# Altium schematic sheet levit_0.1 .SchDoc
size A1; SheetNumber: 1; SheetTotal: 1
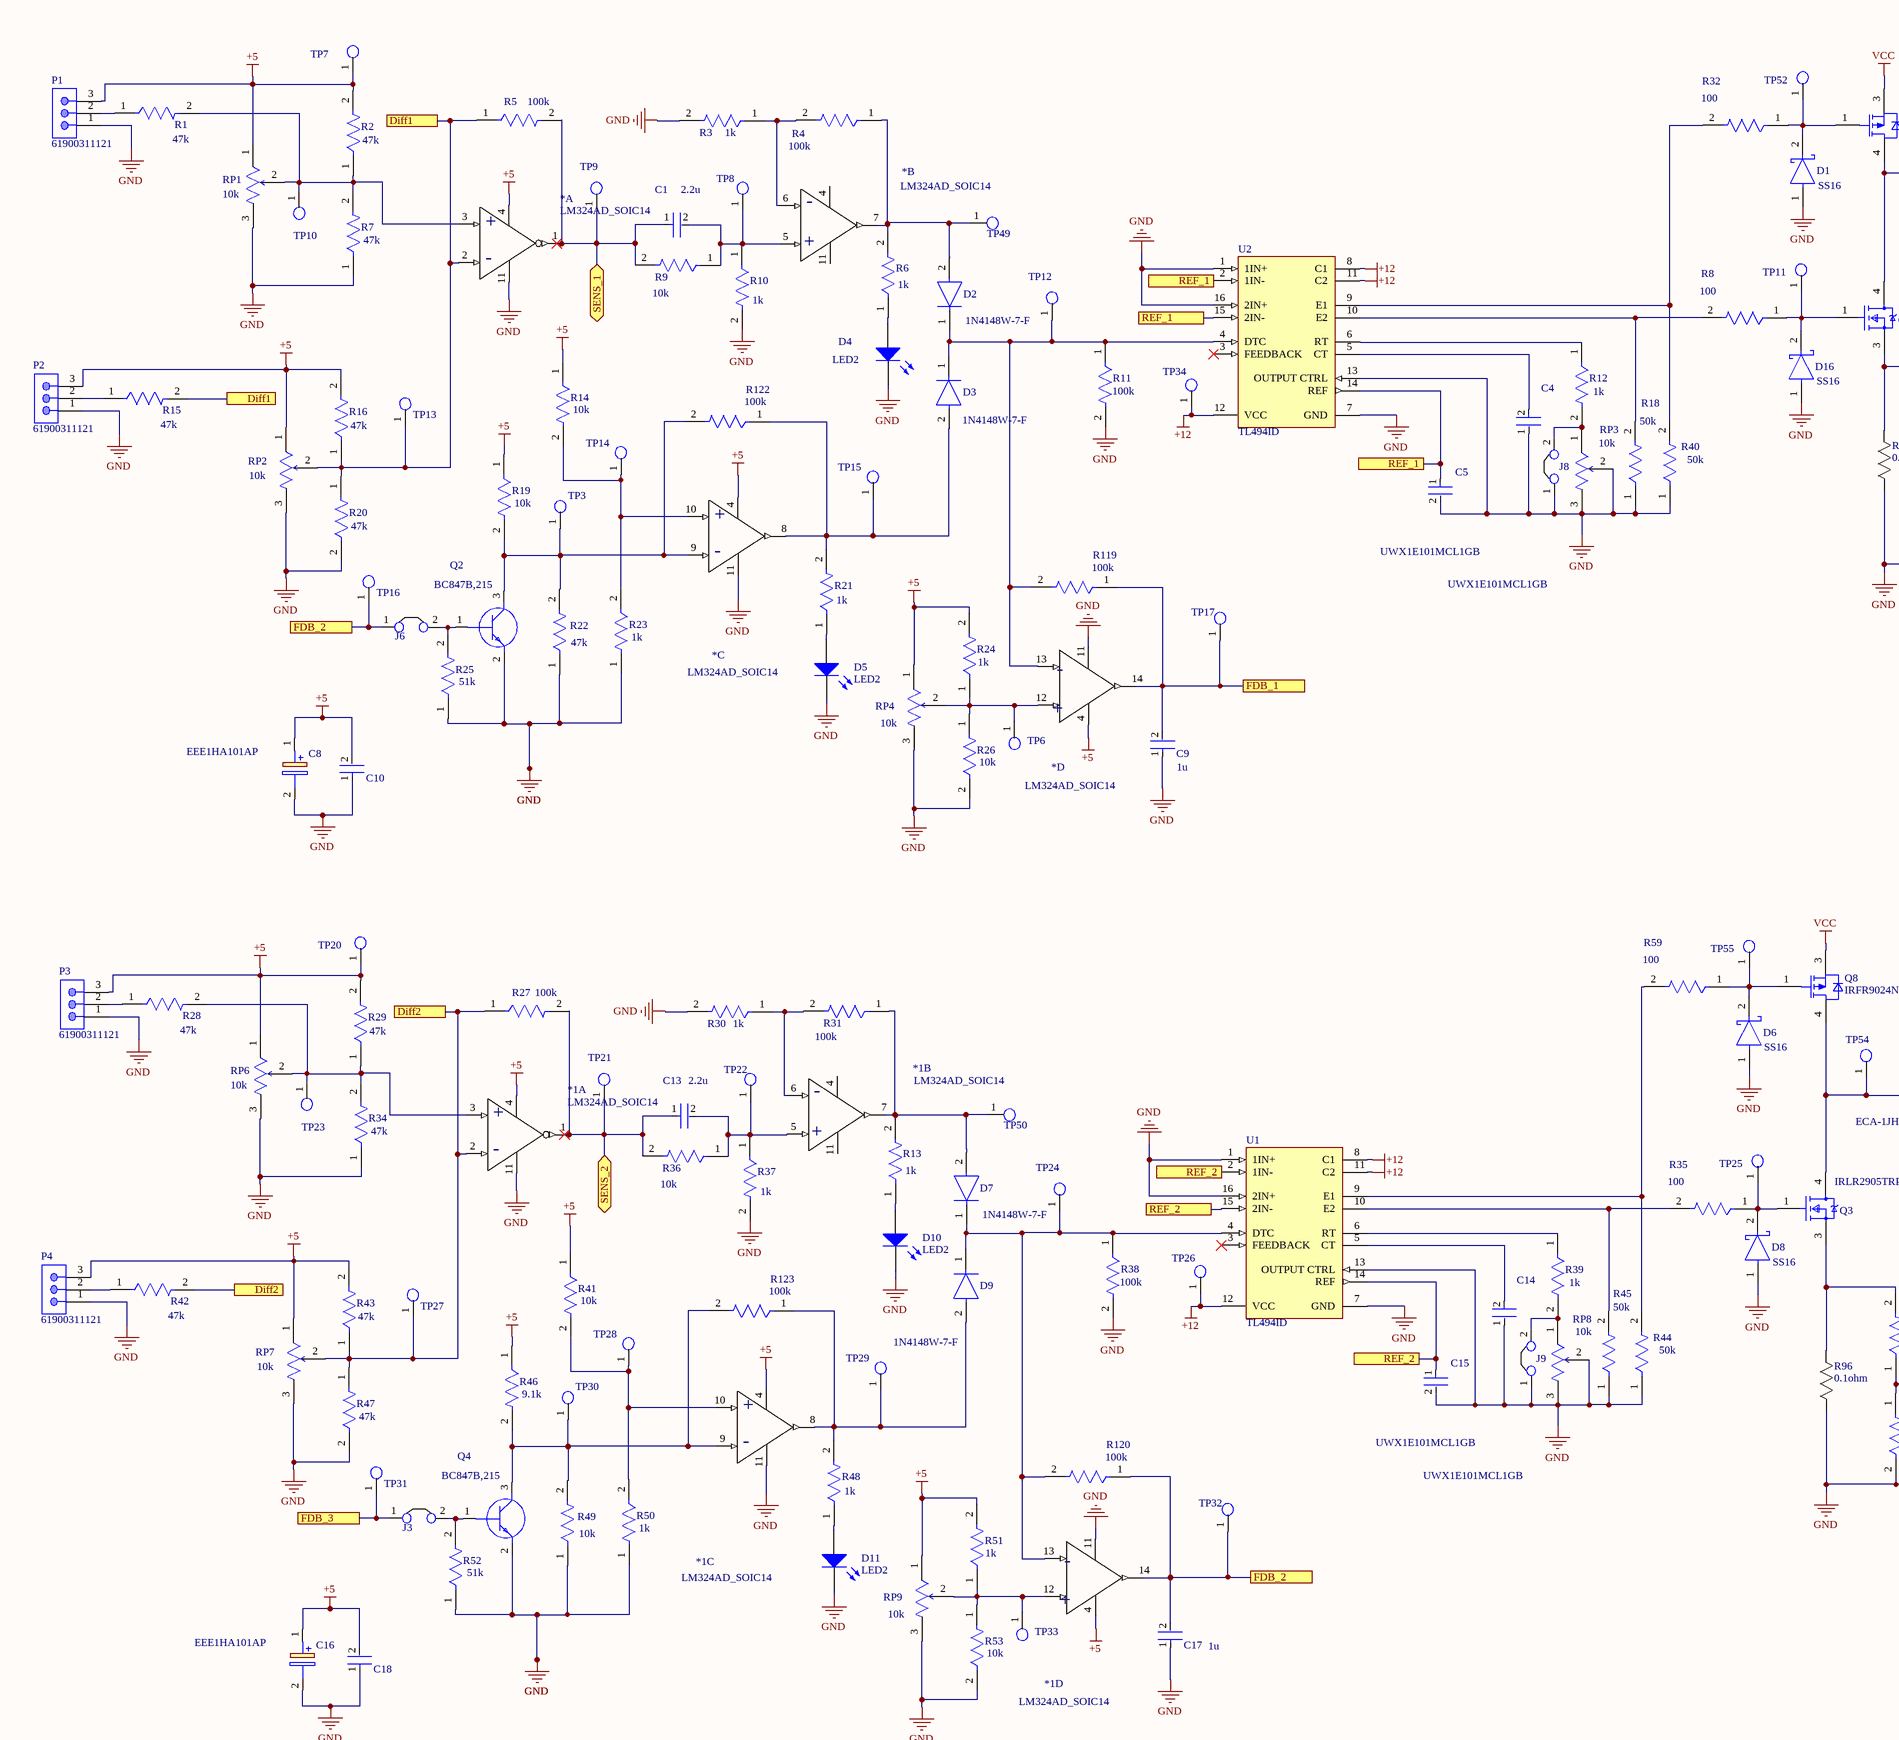
[diagram p0: levit_0.1 .SchDoc, top left]
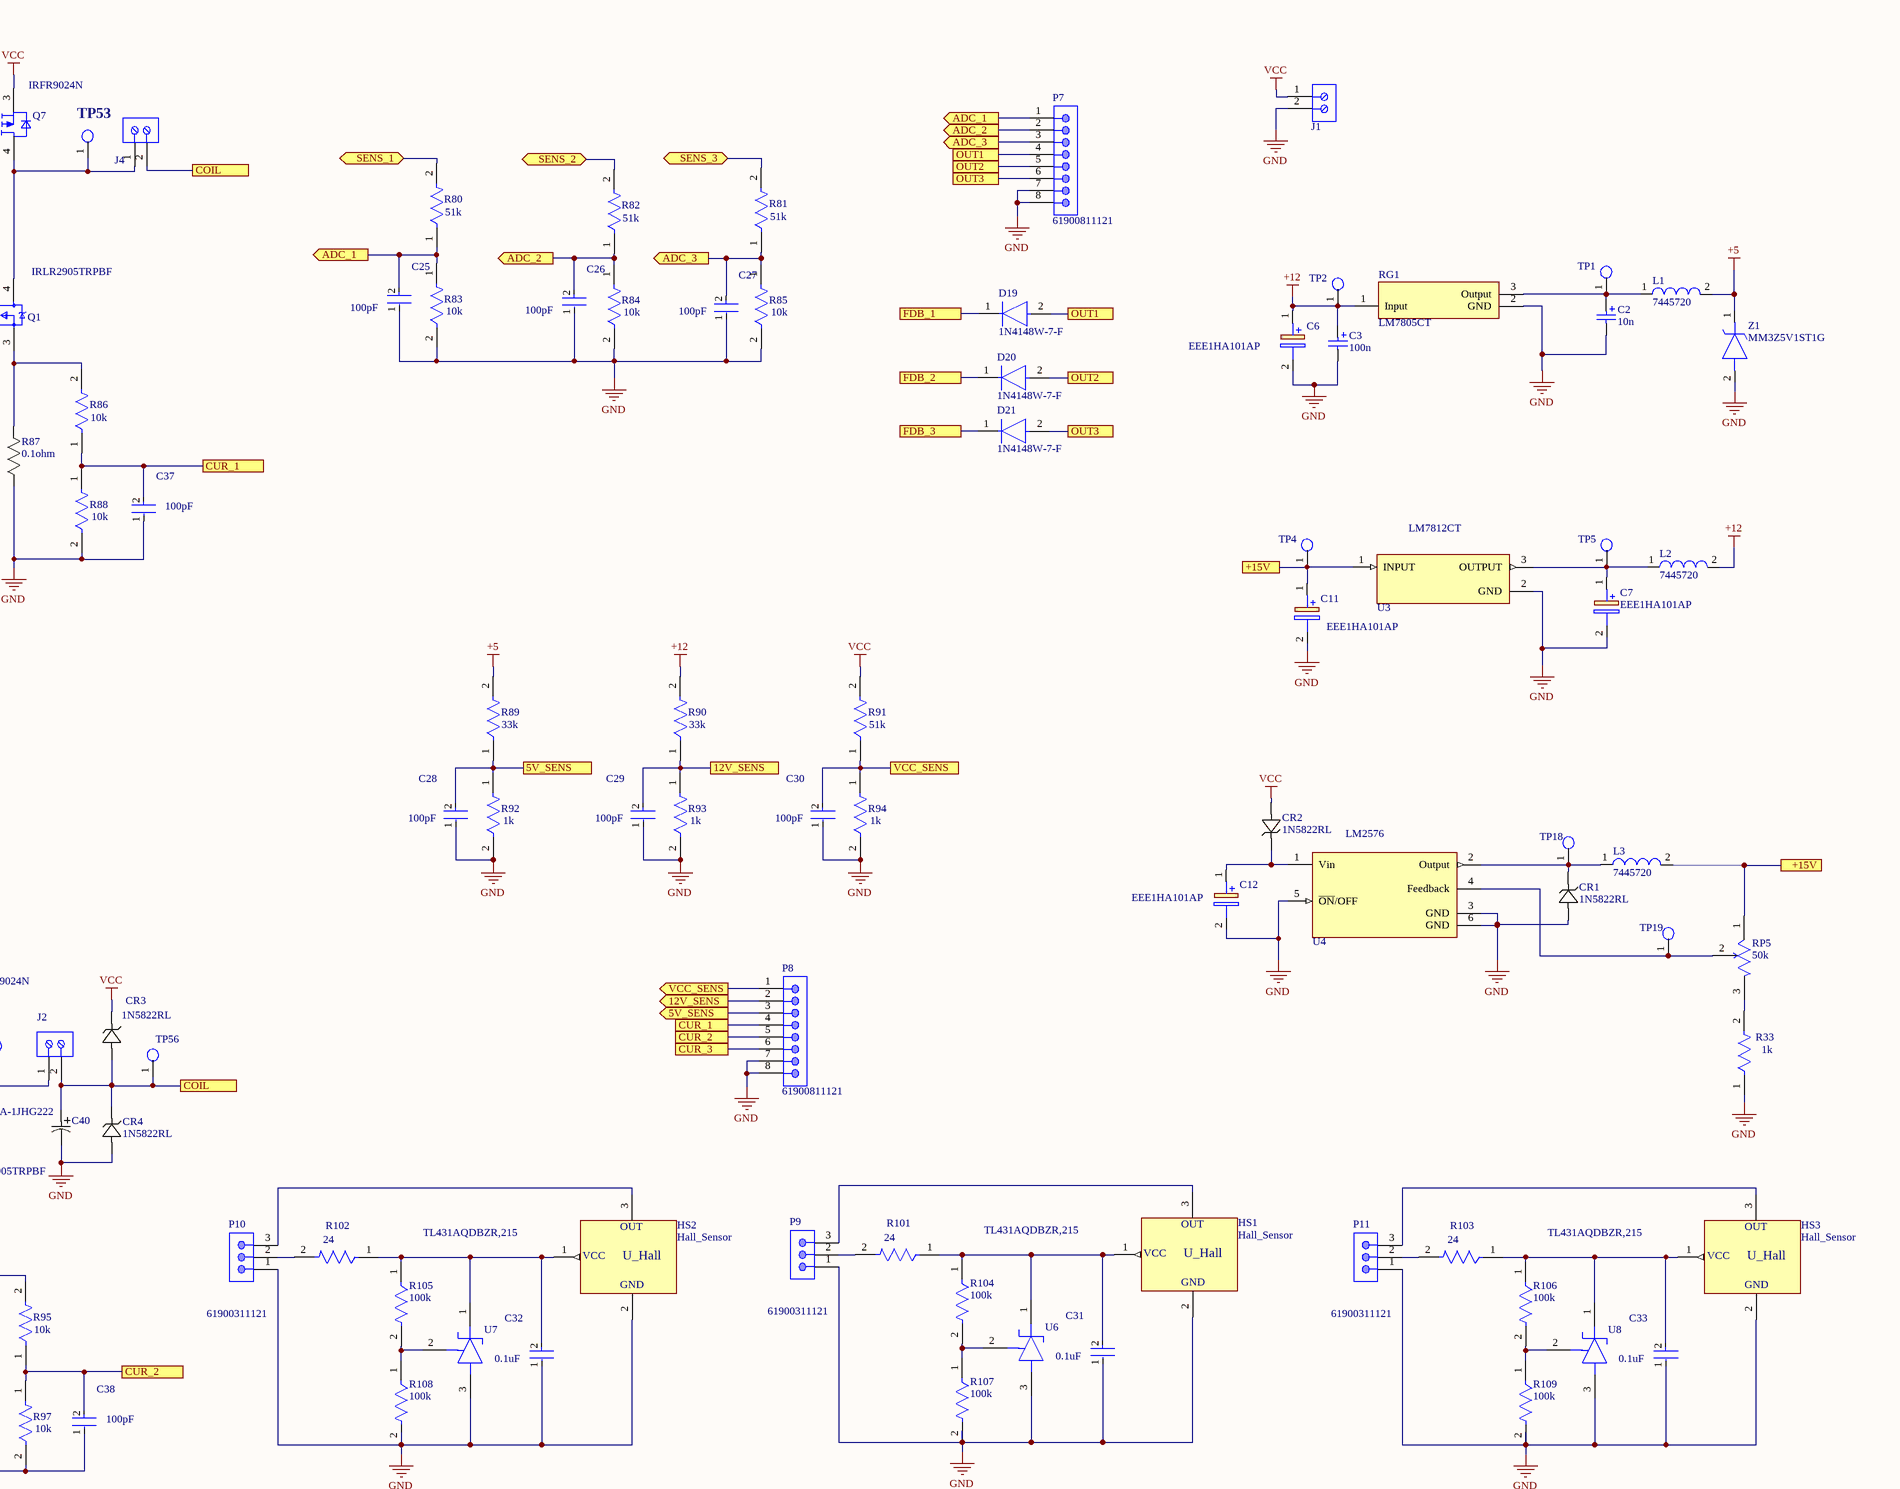
[diagram p1: levit_0.1 .SchDoc, top right]
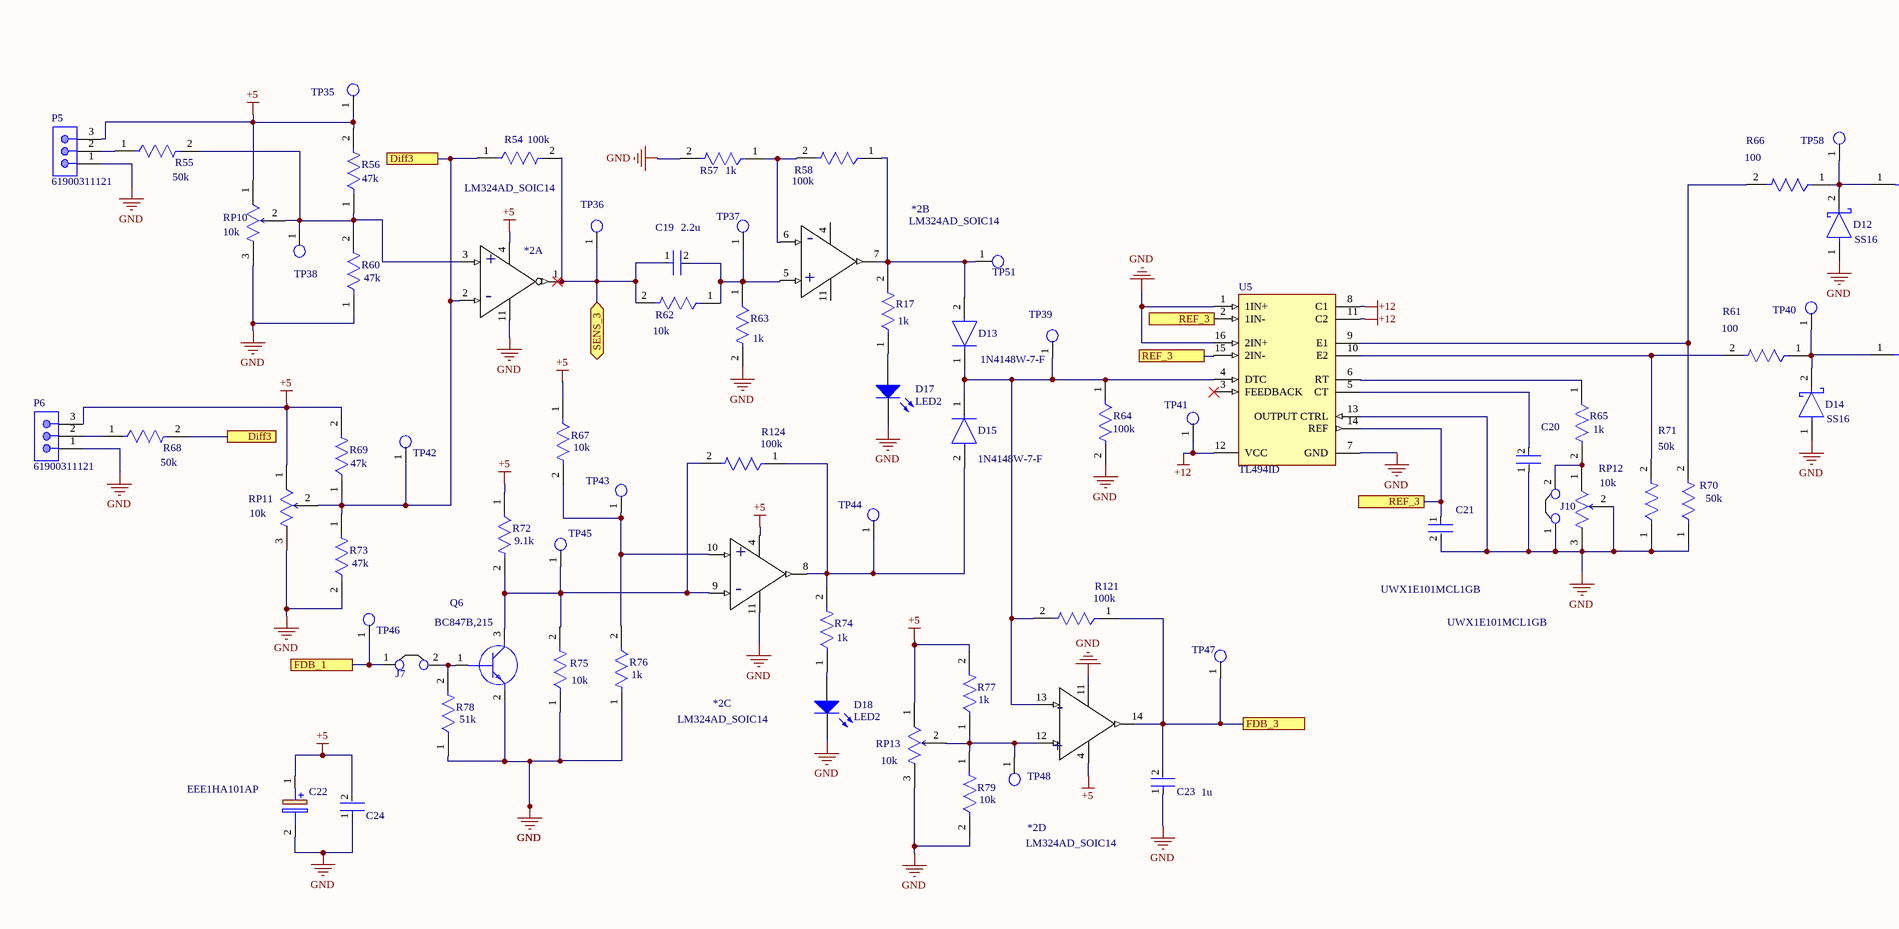
[diagram p2: levit_0.1 .SchDoc, bottom left]
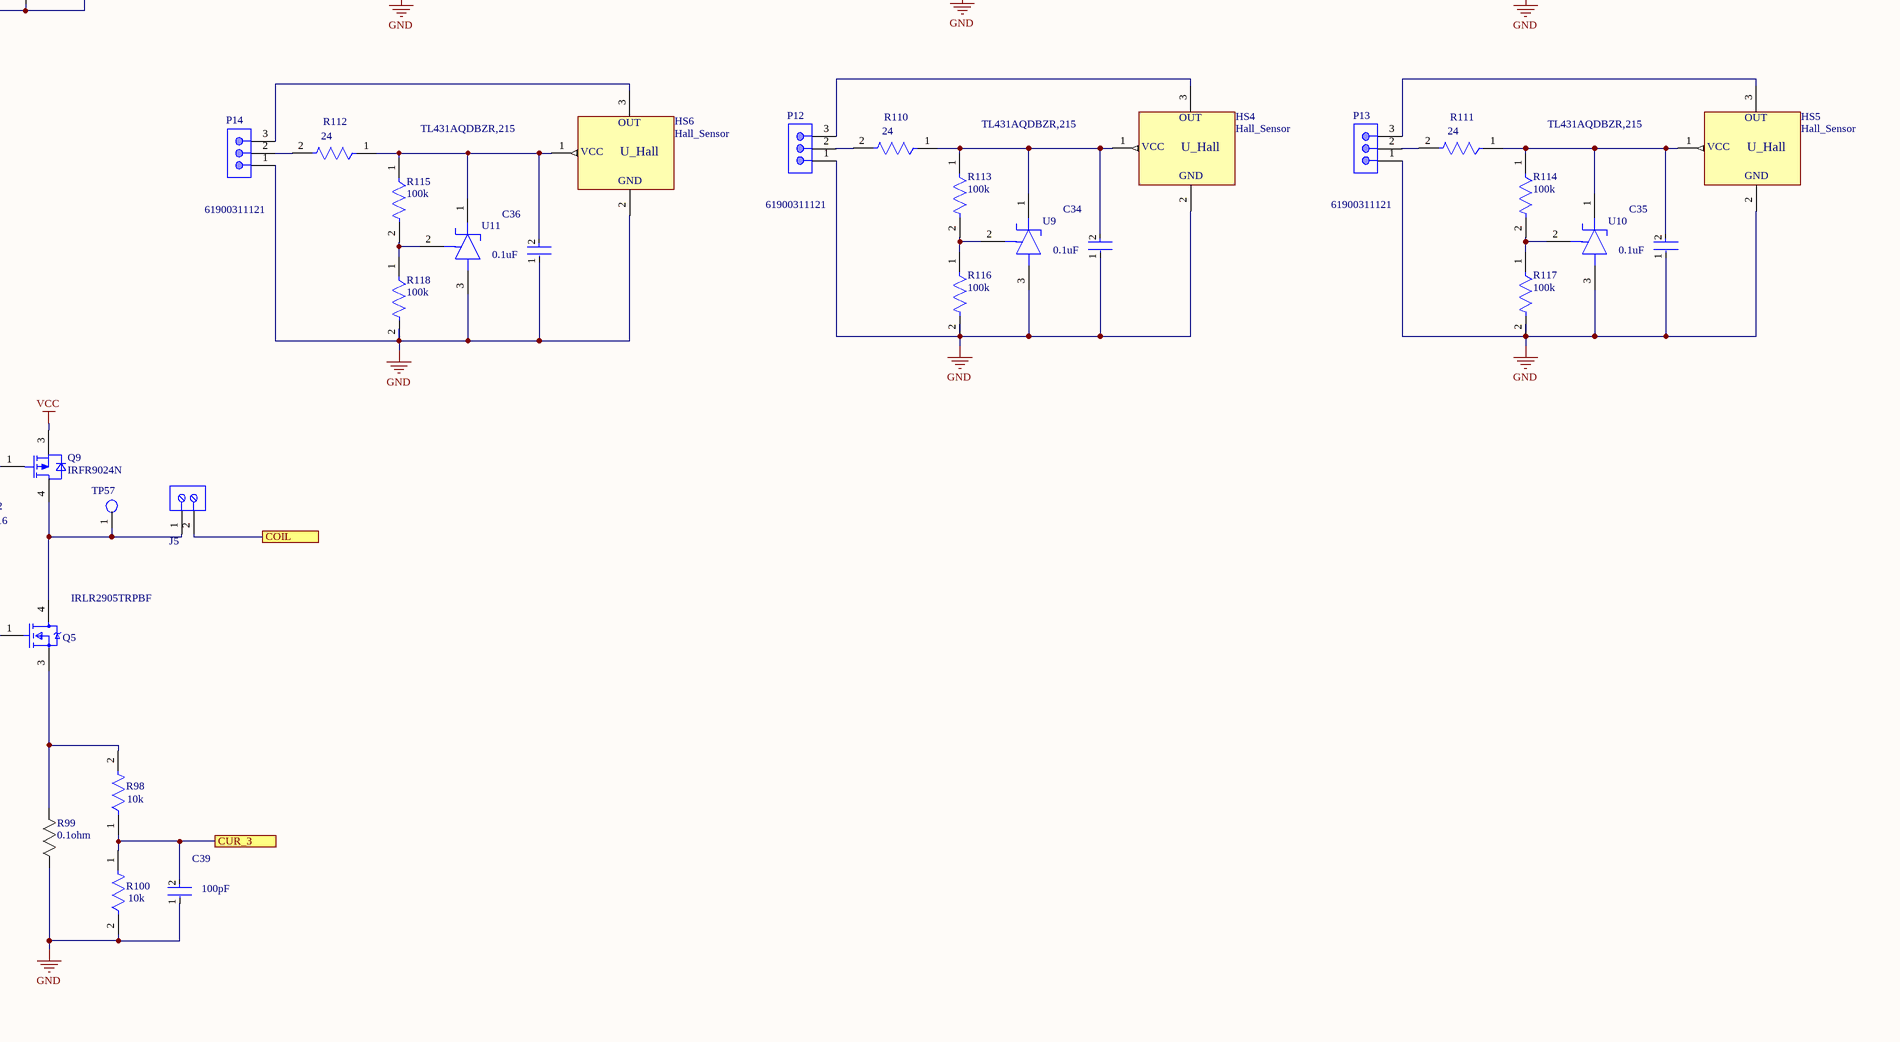
[diagram p3: levit_0.1 .SchDoc, bottom right]

## Parts
(Parts that share a designator on the sheet are numbered #1, #2 ... from top to bottom, then left to right.)
*1  LM324AD_SOIC14  [D14-M]  (parts A,B,C,D of 4)
*2  LM324AD_SOIC14  [D14-M]  (parts A,B,C,D of 4)
*#1  LM324AD_SOIC14  [D14-M]  (part B of 4)
*#2  LM324AD_SOIC14  [D14-M]  (part A of 4)
*#3  LM324AD_SOIC14  [D14-M]  (part C of 4)
*#4  LM324AD_SOIC14  [D14-M]  (part D of 4)
C1  2.2u  [KEMET_C0805C-DN_IPC_A]
C2  10n  [KEMET_C0805C-DN_IPC_A]
C3  100n  [KEMET_C0805C-DN_IPC_A]
C4  UWX1E101MCL1GB  [KEMET_C0805C-DN_IPC_A]
C5  UWX1E101MCL1GB  [KEMET_C0805C-DN_IPC_A]
C6  EEE1HA101AP  [EEEFK1V331P]
C7  EEE1HA101AP  [EEEFK1V331P]
C8  EEE1HA101AP  [EEEFK1V331P]
C9  1u  [KEMET_C0805C-DN_IPC_A]
C10  1u  [KEMET_C0805C-DN_IPC_A]  (value not drawn)
C11  EEE1HA101AP  [EEEFK1V331P]
C12  EEE1HA101AP  [EEEFK1V331P]
C13  2.2u  [KEMET_C0805C-DN_IPC_A]
C14  UWX1E101MCL1GB  [KEMET_C0805C-DN_IPC_A]
C15  UWX1E101MCL1GB  [KEMET_C0805C-DN_IPC_A]
C16  EEE1HA101AP  [EEEFK1V331P]
C17  1u  [KEMET_C0805C-DN_IPC_A]
C18  1u  [KEMET_C0805C-DN_IPC_A]  (value not drawn)
C19  2.2u  [KEMET_C0805C-DN_IPC_A]
C20  UWX1E101MCL1GB  [KEMET_C0805C-DN_IPC_A]
C21  UWX1E101MCL1GB  [KEMET_C0805C-DN_IPC_A]
C22  EEE1HA101AP  [EEEFK1V331P]
C23  1u  [KEMET_C0805C-DN_IPC_A]
C24  1u  [KEMET_C0805C-DN_IPC_A]  (value not drawn)
C25  100pF  [KEMET_C0805C-DN_IPC_A]
C26  100pF  [KEMET_C0805C-DN_IPC_A]
C27  100pF  [KEMET_C0805C-DN_IPC_A]
C28  100pF  [KEMET_C0805C-DN_IPC_A]
C29  100pF  [KEMET_C0805C-DN_IPC_A]
C30  100pF  [KEMET_C0805C-DN_IPC_A]
C31  0.1uF  [KEMET_C0805C-DN_IPC_C]
C32  0.1uF  [KEMET_C0805C-DN_MFG]
C33  0.1uF  [KEMET_C0805C-DN_IPC_C]
C34  0.1uF  [KEMET_C0805C-DN_IPC_C]
C35  0.1uF  [KEMET_C0805C-DN_IPC_C]
C36  0.1uF  [KEMET_C0805C-DN_MFG]
C37  100pF  [KEMET_C0805C-DN_IPC_A]
C38  100pF  [KEMET_C0805C-DN_IPC_A]
C39  100pF  [KEMET_C0805C-DN_IPC_A]
C40  ECA-1JHG222  [PCAP_18x355_PAN]
CR1  1N5822RL  [DO-201AD_STM]
CR2  1N5822RL  [DO-201AD_STM]
CR3  1N5822RL  [DO-201AD_STM]
CR4  1N5822RL  [DO-201AD_STM]
D1  SS16  [ON_Semi_403D_MFG]
D2  1N4148W-7-F  [Vishay_S8-V-3910_01-001_IPC_A]
D3  1N4148W-7-F  [Vishay_S8-V-3910_01-001_IPC_A]
D4  LED2  [Wurth_Electronics_0_MFG]
D5  LED2  [Wurth_Electronics_0_MFG]
D6  SS16  [ON_Semi_403D_MFG]
D7  1N4148W-7-F  [Vishay_S8-V-3910_01-001_IPC_A]
D8  SS16  [Vishay_SS16-E3-61T_0]
D9  1N4148W-7-F  [Vishay_S8-V-3910_01-001_IPC_A]
D10  LED2  [Wurth_Electronics_0_MFG]
D11  LED2  [Wurth_Electronics_0_MFG]
D12  SS16  [ON_Semi_403D_MFG]
D13  1N4148W-7-F  [Vishay_S8-V-3910_01-001_IPC_A]
D14  SS16  [ON_Semi_403D_MFG]
D15  1N4148W-7-F  [Vishay_S8-V-3910_01-001_IPC_A]
D16  SS16  [ON_Semi_403D_MFG]
D17  LED2  [Wurth_Electronics_0_MFG]
D18  LED2  [Wurth_Electronics_0_MFG]
D19  1N4148W-7-F  [Vishay_S8-V-3910_01-001_IPC_A]
D20  1N4148W-7-F  [Vishay_S8-V-3910_01-001_IPC_A]
D21  1N4148W-7-F  [Vishay_S8-V-3910_01-001_IPC_A]
HS1  Hall_Sensor  [TO-92A]
HS2  Hall_Sensor  [TO-92A]
HS3  Hall_Sensor  [TO-92A]
HS4  Hall_Sensor  [TO-92A]
HS5  Hall_Sensor  [TO-92A]
HS6  Hall_Sensor  [TO-92A]
J1  691103110003  [691101710002]  (value not drawn)
J2  691101710002  [691101710002]  (value not drawn)
J3  Jumper 1x2.54  [Jumper_2.54]  (value not drawn)
J4  691101710002  [691101710002]  (value not drawn)
J5  691101710002  [691101710002]  (value not drawn)
J6  Jumper 1x2.54  [Jumper_2.54]  (value not drawn)
J7  Jumper 1x2.54  [Jumper_2.54]  (value not drawn)
J8  Jumper 1x2.54  [Jumper_2.54]  (value not drawn)
J9  Jumper 1x2.54  [Jumper_2.54]  (value not drawn)
J10  Jumper 1x2.54  [Jumper_2.54]  (value not drawn)
L1  7445720  [WE-PD2-L]
L2  7445720  [WE-PD2-L]
L3  7445720  [WE-PD2-L]
P1  61900311121  [61900311121]
P2  61900311121  [61900311121]
P3  61900311121  [61900311121]
P4  61900311121  [61900311121]
P5  61900311121  [61900311121]
P6  61900311121  [61900311121]
P7  61900811121  [61900811121]
P8  61900811121  [61900811121]
P9  61900311121  [61900311121]
P10  61900311121  [61900311121]
P11  61900311121  [61900311121]
P12  61900311121  [61900311121]
P13  61900311121  [61900311121]
P14  61900311121  [61900311121]
Q1  IRLR2905TRPBF  [Infineon_Technologies_PG-TO252-3_MFG]
Q2  BC847B,215  [BC847B215]
Q3  IRLR2905TRPBF  [Infineon_Technologies_PG-TO252-3_MFG]
Q4  BC847B,215  [BC847B215]
Q5  IRLR2905TRPBF  [Infineon_Technologies_PG-TO252-3_MFG]
Q6  BC847B,215  [BC847B215]
Q7  IRFR9024N  [Infineon_Technologies_PG-TO252-3_MFG]
Q8  IRFR9024N  [Infineon_Technologies_PG-TO252-3_MFG]
Q9  IRFR9024N  [Infineon_Technologies_PG-TO252-3_MFG]
R1  47k  [Vishay_CRCW0805-e3_IPC_A]
R2  47k  [Vishay_CRCW0805-e3_IPC_A]
R3  1k  [Vishay_CRCW0805-e3_IPC_A]
R4  100k  [Vishay_CRCW0805-e3_IPC_A]
R5  100k  [Vishay_CRCW0805-e3_IPC_A]
R6  1k  [Vishay_CRCW0805-e3_IPC_A]
R7  47k  [Vishay_CRCW0805-e3_IPC_A]
R8  100  [Vishay_CRCW0805-e3_IPC_A]
R9  10k  [Vishay_CRCW0805-e3_IPC_A]
R10  1k  [Vishay_CRCW0805-e3_IPC_A]
R11  100k  [Vishay_CRCW0805-e3_IPC_A]
R12  1k  [Vishay_CRCW0805-e3_IPC_A]
R13  1k  [Vishay_CRCW0805-e3_IPC_A]
R14  10k  [Vishay_CRCW0805-e3_IPC_A]
R15  47k  [Vishay_CRCW0805-e3_IPC_A]
R16  47k  [Vishay_CRCW0805-e3_IPC_A]
R17  1k  [Vishay_CRCW0805-e3_IPC_A]
R18  50k  [Vishay_CRCW0805-e3_IPC_A]
R19  10k  [Vishay_CRCW0805-e3_IPC_A]
R20  47k  [Vishay_CRCW0805-e3_IPC_A]
R21  1k  [Vishay_CRCW0805-e3_IPC_A]
R22  47k  [Vishay_CRCW0805-e3_IPC_A]
R23  1k  [Vishay_CRCW0805-e3_IPC_A]
R24  1k  [Vishay_CRCW0805-e3_IPC_A]
R25  51k  [Vishay_CRCW0805-e3_IPC_A]
R26  10k  [Vishay_CRCW0805-e3_IPC_A]
R27  100k  [Vishay_CRCW0805-e3_IPC_A]
R28  47k  [Vishay_CRCW0805-e3_IPC_A]
R29  47k  [Vishay_CRCW0805-e3_IPC_A]
R30  1k  [Vishay_CRCW0805-e3_IPC_A]
R31  100k  [Vishay_CRCW0805-e3_IPC_A]
R32  100  [Vishay_CRCW0805-e3_IPC_A]
R33  1k  [Vishay_CRCW0805-e3_IPC_A]
R34  47k  [Vishay_CRCW0805-e3_IPC_A]
R35  100  [Vishay_CRCW0805-e3_IPC_A]
R36  10k  [Vishay_CRCW0805-e3_IPC_A]
R37  1k  [Vishay_CRCW0805-e3_IPC_A]
R38  100k  [Vishay_CRCW0805-e3_IPC_A]
R39  1k  [Vishay_CRCW0805-e3_IPC_A]
R40  50k  [Vishay_CRCW0805-e3_IPC_A]
R41  10k  [Vishay_CRCW0805-e3_IPC_A]
R42  47k  [Vishay_CRCW0805-e3_IPC_A]
R43  47k  [Vishay_CRCW0805-e3_IPC_A]
R44  50k  [Vishay_CRCW0805-e3_IPC_A]
R45  50k  [Vishay_CRCW0805-e3_IPC_A]
R46  9.1k  [Vishay_CRCW0805-e3_IPC_A]
R47  47k  [Vishay_CRCW0805-e3_IPC_A]
R48  1k  [Vishay_CRCW0805-e3_IPC_A]
R49  10k  [Vishay_CRCW0805-e3_IPC_A]
R50  1k  [Vishay_CRCW0805-e3_IPC_A]
R51  1k  [Vishay_CRCW0805-e3_IPC_A]
R52  51k  [Vishay_CRCW0805-e3_IPC_A]
R53  10k  [Vishay_CRCW0805-e3_IPC_A]
R54  100k  [Vishay_CRCW0805-e3_IPC_A]
R55  50k  [Vishay_CRCW0805-e3_IPC_A]
R56  47k  [Vishay_CRCW0805-e3_IPC_A]
R57  1k  [Vishay_CRCW0805-e3_IPC_A]
R58  100k  [Vishay_CRCW0805-e3_IPC_A]
R59  100  [Vishay_CRCW0805-e3_IPC_A]
R60  47k  [Vishay_CRCW0805-e3_IPC_A]
R61  100  [Vishay_CRCW0805-e3_IPC_A]
R62  10k  [Vishay_CRCW0805-e3_IPC_A]
R63  1k  [Vishay_CRCW0805-e3_IPC_A]
R64  100k  [Vishay_CRCW0805-e3_IPC_A]
R65  1k  [Vishay_CRCW0805-e3_IPC_A]
R66  100  [Vishay_CRCW0805-e3_IPC_A]
R67  10k  [Vishay_CRCW0805-e3_IPC_A]
R68  50k  [Vishay_CRCW0805-e3_IPC_A]
R69  47k  [Vishay_CRCW0805-e3_IPC_A]
R70  50k  [Vishay_CRCW0805-e3_IPC_A]
R71  50k  [Vishay_CRCW0805-e3_IPC_A]
R72  9.1k  [Vishay_CRCW0805-e3_IPC_A]
R73  47k  [Vishay_CRCW0805-e3_IPC_A]
R74  1k  [Vishay_CRCW0805-e3_IPC_A]
R75  10k  [Vishay_CRCW0805-e3_IPC_A]
R76  1k  [Vishay_CRCW0805-e3_IPC_A]
R77  1k  [Vishay_CRCW0805-e3_IPC_A]
R78  51k  [Vishay_CRCW0805-e3_IPC_A]
R79  10k  [Vishay_CRCW0805-e3_IPC_A]
R80  51k  [Vishay_CRCW0805-e3_IPC_A]
R81  51k  [Vishay_CRCW0805-e3_IPC_A]
R82  51k  [Vishay_CRCW0805-e3_IPC_A]
R83  10k  [Vishay_CRCW0805-e3_IPC_A]
R84  10k  [Vishay_CRCW0805-e3_IPC_A]
R85  10k  [Vishay_CRCW0805-e3_IPC_A]
R86  10k  [Vishay_CRCW0805-e3_IPC_A]
R87  0.1ohm  [RES_TUM5_OHM]
R88  10k  [Vishay_CRCW0805-e3_IPC_A]
R89  33k  [Vishay_CRCW0805-e3_IPC_A]
R90  33k  [Vishay_CRCW0805-e3_IPC_A]
R91  51k  [Vishay_CRCW0805-e3_IPC_A]
R92  1k  [Vishay_CRCW0805-e3_IPC_A]
R93  1k  [Vishay_CRCW0805-e3_IPC_A]
R94  1k  [Vishay_CRCW0805-e3_IPC_A]
R95  10k  [Vishay_CRCW0805-e3_IPC_A]
R96  0.1ohm  [RES_TUM5_OHM]
R97  10k  [Vishay_CRCW0805-e3_IPC_A]
R98  10k  [Vishay_CRCW0805-e3_IPC_A]
R99  0.1ohm  [RES_TUM5_OHM]
R100  10k  [Vishay_CRCW0805-e3_IPC_A]
R101  24  [Vishay_CRCW0805-e3_IPC_B]
R102  24  [Vishay_CRCW0805-e3_IPC_B]
R103  24  [Vishay_CRCW0805-e3_IPC_B]
R104  100k  [Vishay_CRCW0805-e3_IPC_B]
R105  100k  [Vishay_CRCW0805-e3_IPC_B]
R106  100k  [Vishay_CRCW0805-e3_IPC_B]
R107  100k  [Vishay_CRCW0805-e3_IPC_B]
R108  100k  [Vishay_CRCW0805-e3_IPC_B]
R109  100k  [Vishay_CRCW0805-e3_IPC_B]
R110  24  [Vishay_CRCW0805-e3_IPC_B]
R111  24  [Vishay_CRCW0805-e3_IPC_B]
R112  24  [Vishay_CRCW0805-e3_IPC_B]
R113  100k  [Vishay_CRCW0805-e3_IPC_B]
R114  100k  [Vishay_CRCW0805-e3_IPC_B]
R115  100k  [Vishay_CRCW0805-e3_IPC_B]
R116  100k  [Vishay_CRCW0805-e3_IPC_B]
R117  100k  [Vishay_CRCW0805-e3_IPC_B]
R118  100k  [Vishay_CRCW0805-e3_IPC_B]
R119  100k  [Vishay_CRCW0805-e3_IPC_A]
R120  100k  [Vishay_CRCW0805-e3_IPC_A]
R121  100k  [Vishay_CRCW0805-e3_IPC_A]
R122  100k  [Vishay_CRCW0805-e3_IPC_A]
R123  100k  [Vishay_CRCW0805-e3_IPC_A]
R124  100k  [Vishay_CRCW0805-e3_IPC_A]
RG1  Part Number: LM7805CT  [Fairchild_LM7805CT_0]  (hidden comment: Reg_Fairchild_LM7805CT_eec)
RP1  10k  [Bourns_3296W_MFG]
RP2  10k  [Bourns_3296W_MFG]
RP3  10k  [Bourns_3296W_MFG]
RP4  10k  [Bourns_3296W_MFG]
RP5  50k  [Bourns_3296W_MFG]
RP6  10k  [Bourns_3296W_MFG]
RP7  10k  [Bourns_3296W_MFG]
RP8  10k  [Bourns_3296W_MFG]
RP9  10k  [Bourns_3296W_MFG]
RP10  10k  [Bourns_3296W_MFG]
RP11  10k  [Bourns_3296W_MFG]
RP12  10k  [Bourns_3296W_MFG]
RP13  10k  [Bourns_3296W_MFG]
TP1  Test_Point_PCB  [Test_Point]  (value not drawn)
TP2  Test_Point_PCB  [Test_Point]  (value not drawn)
TP3  Test_Point_PCB  [Test_Point]  (value not drawn)
TP4  Test_Point_PCB  [Test_Point]  (value not drawn)
TP5  Test_Point_PCB  [Test_Point]  (value not drawn)
TP6  Test_Point_PCB  [Test_Point]  (value not drawn)
TP7  Test_Point_PCB  [Test_Point]  (value not drawn)
TP8  Test_Point_PCB  [Test_Point]  (value not drawn)
TP9  Test_Point_PCB  [Test_Point]  (value not drawn)
TP10  Test_Point_PCB  [Test_Point]  (value not drawn)
TP11  Test_Point_PCB  [Test_Point]  (value not drawn)
TP12  Test_Point_PCB  [Test_Point]  (value not drawn)
TP13  Test_Point_PCB  [Test_Point]  (value not drawn)
TP14  Test_Point_PCB  [Test_Point]  (value not drawn)
TP15  Test_Point_PCB  [Test_Point]  (value not drawn)
TP16  Test_Point_PCB  [Test_Point]  (value not drawn)
TP17  Test_Point_PCB  [Test_Point]  (value not drawn)
TP18  Test_Point_PCB  [Test_Point]  (value not drawn)
TP19  Test_Point_PCB  [Test_Point]  (value not drawn)
TP20  Test_Point_PCB  [Test_Point]  (value not drawn)
TP21  Test_Point_PCB  [Test_Point]  (value not drawn)
TP22  Test_Point_PCB  [Test_Point]  (value not drawn)
TP23  Test_Point_PCB  [Test_Point]  (value not drawn)
TP24  Test_Point_PCB  [Test_Point]  (value not drawn)
TP25  Test_Point_PCB  [Test_Point]  (value not drawn)
TP26  Test_Point_PCB  [Test_Point]  (value not drawn)
TP27  Test_Point_PCB  [Test_Point]  (value not drawn)
TP28  Test_Point_PCB  [Test_Point]  (value not drawn)
TP29  Test_Point_PCB  [Test_Point]  (value not drawn)
TP30  Test_Point_PCB  [Test_Point]  (value not drawn)
TP31  Test_Point_PCB  [Test_Point]  (value not drawn)
TP32  Test_Point_PCB  [Test_Point]  (value not drawn)
TP33  Test_Point_PCB  [Test_Point]  (value not drawn)
TP34  Test_Point_PCB  [Test_Point]  (value not drawn)
TP35  Test_Point_PCB  [Test_Point]  (value not drawn)
TP36  Test_Point_PCB  [Test_Point]  (value not drawn)
TP37  Test_Point_PCB  [Test_Point]  (value not drawn)
TP38  Test_Point_PCB  [Test_Point]  (value not drawn)
TP39  Test_Point_PCB  [Test_Point]  (value not drawn)
TP40  Test_Point_PCB  [Test_Point]  (value not drawn)
TP41  Test_Point_PCB  [Test_Point]  (value not drawn)
TP42  Test_Point_PCB  [Test_Point]  (value not drawn)
TP43  Test_Point_PCB  [Test_Point]  (value not drawn)
TP44  Test_Point_PCB  [Test_Point]  (value not drawn)
TP45  Test_Point_PCB  [Test_Point]  (value not drawn)
TP46  Test_Point_PCB  [Test_Point]  (value not drawn)
TP47  Test_Point_PCB  [Test_Point]  (value not drawn)
TP48  Test_Point_PCB  [Test_Point]  (value not drawn)
TP49  Test_Point_PCB  [Test_Point]  (value not drawn)
TP50  Test_Point_PCB  [Test_Point]  (value not drawn)
TP51  Test_Point_PCB  [Test_Point]  (value not drawn)
TP52  Test_Point_PCB  [Test_Point]  (value not drawn)
TP53  Test_Point_PCB  [Test_Point]  (value not drawn)
TP54  Test_Point_PCB  [Test_Point]  (value not drawn)
TP55  Test_Point_PCB  [Test_Point]  (value not drawn)
TP56  Test_Point_PCB  [Test_Point]  (value not drawn)
TP57  Test_Point_PCB  [Test_Point]  (value not drawn)
TP58  Test_Point_PCB  [Test_Point]  (value not drawn)
U1  TL494ID  [D16-M]
U2  TL494ID  [D16-M]
U3  LM7812CT  [Fairchild_LM7805CT_0]
U4  LM2576  [ON_Semiconductor_936A-02_MFG]
U5  TL494ID  [D16-M]
U6  Part Number: TL431AQDBZR,215  [Nexperia_TL431AQDBZR,215_0]  (hidden comment: IC_Nexperia_TL431AQDBZR,215_eec)
U7  Part Number: TL431AQDBZR,215  [Nexperia_TL431AQDBZR,215_0]  (hidden comment: IC_Nexperia_TL431AQDBZR,215_eec)
U8  Part Number: TL431AQDBZR,215  [Nexperia_TL431AQDBZR,215_0]  (hidden comment: IC_Nexperia_TL431AQDBZR,215_eec)
U9  Part Number: TL431AQDBZR,215  [Nexperia_TL431AQDBZR,215_0]  (hidden comment: IC_Nexperia_TL431AQDBZR,215_eec)
U10  Part Number: TL431AQDBZR,215  [Nexperia_TL431AQDBZR,215_0]  (hidden comment: IC_Nexperia_TL431AQDBZR,215_eec)
U11  Part Number: TL431AQDBZR,215  [Nexperia_TL431AQDBZR,215_0]  (hidden comment: IC_Nexperia_TL431AQDBZR,215_eec)
Z1  MM3Z5V1ST1G  [SOD2512X110N]

## Ports
5V_SENS, 5V_SENS (out), 12V_SENS, 12V_SENS (out), +15V, ADC_1 (out), ADC_2 (out), ADC_3 (out), COIL, CUR_1, CUR_2, CUR_3, Diff1, Diff2, Diff3, FDB_1, FDB_2, FDB_3, OUT1, OUT2, OUT3, REF_1, REF_2, REF_3, SENS_1 (bidir), SENS_2 (bidir), SENS_3 (bidir), VCC_SENS, VCC_SENS (out)

## Nets
+5: *1.4(+VCC) *2.4(+VCC) *#2.4(+VCC) *#3.4 *#4.4 C8.1(+) C10.2 C16.1(+) C18.2 C22.1(+) C24.2 L1.2 P1.3 P2.3 P3.3 P4.3 P5.3 P6.3 R2.2 R14.1 R16.2 R19.1 R24.2 R29.2 R41.1 R43.2 R46.1 R51.2 R56.2 R67.1 R69.2 R72.1 R77.2 R89.2 RP1.1(CCW) RP2.1(CCW) RP4.1(CCW) RP6.1(CCW) RP7.1(CCW) RP9.1(CCW) RP10.1(CCW) RP11.1(CCW) RP13.1(CCW) TP7.1(G9) TP20.1(G9) TP35.1(G9) Z1.1(K)
+12: C3.1 C6.1(+) L2.2 R90.2 RG1.1(Input) TP2.1(G9) TP26.1(G9) TP34.1(G9) TP41.1(G9) U1.8(C1) U1.11(C2) U1.12(VCC) U2.8(C1) U2.11(C2) U2.12(VCC) U5.8(C1) U5.11(C2) U5.12(VCC)
GND: *1.11(GND) *2.11(GND) *#2.11(GND) *#3.11(GND) *#4.11(GND) C2.2 C3.2 C4.1 C5.2 C6.2(-) C7.2(-) C8.2(-) C9.1 C10.1 C11.2(-) C12.2(-) C14.1 C15.2 C16.2(-) C17.1 C18.1 C20.1 C21.2 C22.2(-) C23.1 C24.1 C25.1 C26.1 C27.1 C28.1 C29.1 C30.1 C31.1 C32.1 C33.1 C34.1 C35.1 C36.1 C37.1 C38.1 C39.1 C40.2 CR1.2 CR4.2 D1.1(C) D4.2(K) D5.2(K) D6.1(C) D8.1(C) D10.2(K) D11.2(K) D12.1(C) D14.1(C) D16.1(C) D17.2(K) D18.2(K) HS1.2(GND) HS2.2(GND) HS3.2(GND) HS4.2(GND) HS5.2(GND) HS6.2(GND) J1.2 J8.1 J9.1 J10.1 P1.1 P2.1 P3.1 P4.1 P5.1 P6.1 P7.7 P7.8 P8.7 P8.8 P9.1 P10.1 P11.1 P12.1 P13.1 P14.1 Q2.2(E) Q4.2(E) Q6.2(E) R3.2 R7.1 R10.2 R11.2 R18.1 R20.2 R22.1 R23.1 R25.1 R26.2 R30.2 R33.1 R34.1 R37.2 R38.2 R40.1 R44.1 R45.1 R47.2 R49.1 R50.1 R52.1 R53.2 R57.2 R60.1 R63.2 R64.2 R70.1 R71.1 R73.2 R75.1 R76.1 R78.1 R79.2 R83.2 R84.2 R85.2 R87.1 R88.2 R92.2 R93.2 R94.2 R96.1 R97.2 R99.1 R100.2 R107.2 R108.2 R109.2 R116.2 R117.2 R118.2 RG1.2(GND) RP1.3(CW) RP2.3(CW) RP3.2(WIPER) RP3.3(CW) RP4.3(CW) RP6.3(CW) RP7.3(CW) RP8.2(WIPER) RP8.3(CW) RP9.3(CW) RP10.3(CW) RP11.3(CW) RP12.2(WIPER) RP12.3(CW) RP13.3(CW) U1.1(1IN+) U1.7(GND) U1.13(OUTPUT_CTRL) U1.16(2IN+) U2.1(1IN+) U2.7(GND) U2.13(OUTPUT_CTRL) U2.16(2IN+) U3.2(GND) U4.3(GND) U4.5(~{ON}/OFF) U4.6(GND) U5.1(1IN+) U5.7(GND) U5.13(OUTPUT_CTRL) U5.16(2IN+) U6.3(a) U7.3(a) U8.3(a) U9.3(a) U10.3(a) U11.3(a) Z1.2(A)
VCC: CR2.2 CR3.1 J1.1 Q7.3(SOURCE) Q8.3(SOURCE) Q9.3(SOURCE) R91.2
5V_SENS: C28.2 P8.3 R89.1 R92.1 ; port 5V_SENS
12V_SENS: C29.2 P8.2 R90.1 R93.1 ; port 12V_SENS
+15V: C11.1(+) L3.2 RP5.1(CCW) TP4.1(G9) U3.1(INPUT) ; port +15V
ADC_1: C25.2 P7.1 R80.1 R83.1 ; port ADC_1
ADC_2: C26.2 P7.2 R82.1 R84.1 ; port ADC_2
ADC_3: C27.2 P7.3 R81.1 R85.1 ; port ADC_3
COIL: C40.1 CR3.2 CR4.1 J2.2 J4.2 J5.2 TP56.1(G9) ; port COIL
CUR_1: C37.2 P8.4 R86.1 R88.1 ; port CUR_1
CUR_2: C38.2 P8.5 R95.1 R97.1 ; port CUR_2
CUR_3: C39.2 P8.6 R98.1 R100.1 ; port CUR_3
Diff1: *#2.2(-INP_1) R5.1 R15.2 R16.1 R20.1 RP2.2(WIPER) TP13.1(G9) ; port Diff1
Diff2: *1.2(-INP_1) R27.1 R42.2 R43.1 R47.1 RP7.2(WIPER) TP27.1(G9) ; port Diff2
Diff3: *2.2(-INP_1) R54.1 R68.2 R69.1 R73.1 RP11.2(WIPER) TP42.1(G9) ; port Diff3
FDB_1: *#4.14(OUT_4) C9.2 D19.1(C) J7.1 R119.1 TP17.1(G9) TP46.1(G9) ; port FDB_1
FDB_2: *1.14(OUT_4) C17.2 D20.1(C) J6.1 R120.1 TP16.1(G9) TP32.1(G9) ; port FDB_2
FDB_3: *2.14(OUT_4) C23.2 D21.1(C) J3.1 R121.1 TP31.1(G9) TP47.1(G9) ; port FDB_3
OUT1: D19.2(A) P7.4 ; port OUT1
OUT2: D20.2(A) P7.5 ; port OUT2
OUT3: D21.2(A) P7.6 ; port OUT3
REF_1: C5.1 U2.2(1IN-) U2.14(REF) U2.15(2IN-) ; port REF_1
REF_2: C15.1 U1.2(1IN-) U1.14(REF) U1.15(2IN-) ; port REF_2
REF_3: C21.1 U5.2(1IN-) U5.14(REF) U5.15(2IN-) ; port REF_3
SENS_1: *#2.1(OUT_1) C1.1 R5.2 R9.2 R80.2 TP9.1(G9) ; port SENS_1
SENS_2: *1.1(OUT_1) C13.1 R27.2 R36.2 R82.2 TP21.1(G9) ; port SENS_2
SENS_3: *2.1(OUT_1) C19.1 R54.2 R62.2 R81.2 TP36.1(G9) ; port SENS_3
VCC_SENS: C30.2 P8.1 R91.1 R94.1 ; port VCC_SENS
Net*1_3: *1.3(+INP_1) R28.2 R29.1 R34.2 RP6.2(WIPER) TP23.1(G9)
Net*1_5: *1.5(+INP_2) C13.2 R36.1 R37.1 TP22.1(G9)
Net*1_6: *1.6(-INP_2) R30.1 R31.2
Net*1_7: *1.7(OUT_2) D7.2(A) R13.2 R31.1 TP50.1(G9)
Net*1_8: *1.8(OUT_3) D9.2(A) R48.2 R123.1 TP29.1(G9)
Net*1_9: *1.9(-INP_3) Q4.3(C) R46.2 R49.2 R123.2 TP30.1(G9)
Net*1_10: *1.10(+INP_3) R41.2 R50.2 TP28.1(G9)
Net*1_12: *1.12(+INP_4) R51.1 R53.1 RP9.2(WIPER) TP33.1(G9)
Net*1_13: *1.13(-INP_4) D7.1(C) D9.1(C) R38.1 R120.2 TP24.1(G9) U1.4(DTC)
Net*2_3: *2.3(+INP_1) R55.2 R56.1 R60.2 RP10.2(WIPER) TP38.1(G9)
Net*2_5: *2.5(+INP_2) C19.2 R62.1 R63.1 TP37.1(G9)
Net*2_6: *2.6(-INP_2) R57.1 R58.2
Net*2_7: *2.7(OUT_2) D13.2(A) R17.2 R58.1 TP51.1(G9)
Net*2_8: *2.8(OUT_3) D15.2(A) R74.2 R124.1 TP44.1(G9)
Net*2_9: *2.9(-INP_3) Q6.3(C) R72.2 R75.2 R124.2 TP45.1(G9)
Net*2_10: *2.10(+INP_3) R67.2 R76.2 TP43.1(G9)
Net*2_12: *2.12(+INP_4) R77.1 R79.1 RP13.2(WIPER) TP48.1(G9)
Net*2_13: *2.13(-INP_4) D13.1(C) D15.1(C) R64.1 R121.2 TP39.1(G9) U5.4(DTC)
Net*#1_5: *#1.5(+INP_2) C1.2 R9.1 R10.1 TP8.1(G9)
Net*#1_6: *#1.6(-INP_2) R3.1 R4.2
Net*#1_7: *#1.7(OUT_2) D2.2(A) R4.1 R6.2 TP49.1(G9)
Net*#2_3: *#2.3(+INP_1) R1.2 R2.1 R7.2 RP1.2(WIPER) TP10.1(G9)
Net*#3_8: *#3.8(OUT_3) D3.2(A) R21.2 R122.1 TP15.1(G9)
Net*#3_9: *#3.9(-INP_3) Q2.3(C) R19.2 R22.2 R122.2 TP3.1(G9)
Net*#3_10: *#3.10(+INP_3) R14.2 R23.2 TP14.1(G9)
Net*#4_12: *#4.12(+INP_4) R24.1 R26.1 RP4.2(WIPER) TP6.1(G9)
Net*#4_13: *#4.13(-INP_4) D2.1(C) D3.1(C) R11.1 R119.2 TP12.1(G9) U2.4(DTC)
NetC2_1: C2.1 L1.1 RG1.3(Output) TP1.1(G9)
NetC4_2: C4.2 U2.5(CT)
NetC7_1: C7.1(+) L2.1 TP5.1(G9) U3.3(OUTPUT)
NetC12_1: C12.1(+) CR2.1 U4.1(Vin)
NetC14_2: C14.2 U1.5(CT)
NetC20_2: C20.2 U5.5(CT)
NetC31_2: C31.2 HS1.1(OUT) R101.1 R104.1 U6.1(k)
NetC32_2: C32.2 HS2.1(OUT) R102.1 R105.1 U7.1(k)
NetC33_2: C33.2 HS3.1(OUT) R103.1 R106.1 U8.1(k)
NetC34_2: C34.2 HS4.1(OUT) R110.1 R113.1 U9.1(k)
NetC35_2: C35.2 HS5.1(OUT) R111.1 R114.1 U10.1(k)
NetC36_2: C36.2 HS6.1(OUT) R112.1 R115.1 U11.1(k)
NetCR1_1: CR1.1 L3.1 TP18.1(G9) U4.2(Output)
NetD1_2: D1.2(A) Q7.1(GATE) R32.1 TP52.1(G9)
NetD4_1: D4.1(A) R6.1
NetD5_1: D5.1(A) R21.1
NetD6_2: D6.2(A) Q8.1(GATE) R59.1 TP55.1(G9)
NetD8_2: D8.2(A) Q3.1(GATE) R35.1 TP25.1(G9)
NetD10_1: D10.1(A) R13.1
NetD11_1: D11.1(A) R48.1
NetD12_2: D12.2(A) Q9.1(GATE) R66.1 TP58.1(G9)
NetD14_2: D14.2(A) Q5.1(GATE) R61.1 TP40.1(G9)
NetD16_2: D16.2(A) Q1.1(GATE) R8.1 TP11.1(G9)
NetD17_1: D17.1(A) R17.1
NetD18_1: D18.1(A) R74.1
NetHS1_3: HS1.3(VCC) P9.3
NetHS2_3: HS2.3(VCC) P10.3
NetHS3_3: HS3.3(VCC) P11.3
NetHS4_3: HS4.3(VCC) P12.3
NetHS5_3: HS5.3(VCC) P13.3
NetHS6_3: HS6.3(VCC) P14.3
NetJ2_1: J2.1 Q3.4(DRAIN) Q8.4(DRAIN) TP54.1(G9)
NetJ3_2: J3.2 Q4.1(B) R52.2
NetJ4_1: J4.1 Q1.4(DRAIN) Q7.4(DRAIN) TP53.1(G9)
NetJ5_1: J5.1 Q5.4(DRAIN) Q9.4(DRAIN) TP57.1(G9)
NetJ6_2: J6.2 Q2.1(B) R25.2
NetJ7_2: J7.2 Q6.1(B) R78.2
NetJ8_2: J8.2 R12.2 RP3.1(CCW)
NetJ9_2: J9.2 R39.2 RP8.1(CCW)
NetJ10_2: J10.2 R65.2 RP12.1(CCW)
NetP1_2: P1.2 R1.1
NetP2_2: P2.2 R15.1
NetP3_2: P3.2 R28.1
NetP4_2: P4.2 R42.1
NetP5_2: P5.2 R55.1
NetP6_2: P6.2 R68.1
NetP9_2: P9.2 R101.2
NetP10_2: P10.2 R102.2
NetP11_2: P11.2 R103.2
NetP12_2: P12.2 R110.2
NetP13_2: P13.2 R111.2
NetP14_2: P14.2 R112.2
NetQ1_3: Q1.3(SOURCE) R86.2 R87.2
NetQ3_3: Q3.3(SOURCE) R95.2 R96.2
NetQ5_3: Q5.3(SOURCE) R98.2 R99.2
NetR8_2: R8.2 R18.2 U2.10(E2)
NetR12_1: R12.1 U2.6(RT)
NetR32_2: R32.2 R40.2 U2.9(E1)
NetR33_2: R33.2 RP5.3(CW)
NetR35_2: R35.2 R45.2 U1.10(E2)
NetR39_1: R39.1 U1.6(RT)
NetR44_2: R44.2 R59.2 U1.9(E1)
NetR61_2: R61.2 R71.2 U5.10(E2)
NetR65_1: R65.1 U5.6(RT)
NetR66_2: R66.2 R70.2 U5.9(E1)
NetR104_2: R104.2 R107.1 U6.2(REF)
NetR105_2: R105.2 R108.1 U7.2(REF)
NetR106_2: R106.2 R109.1 U8.2(REF)
NetR113_2: R113.2 R116.1 U9.2(REF)
NetR114_2: R114.2 R117.1 U10.2(REF)
NetR115_2: R115.2 R118.1 U11.2(REF)
NetRP5_2: RP5.2(WIPER) TP19.1(G9) U4.4(Feedback)

Not connected (* = marked no-connect by the designer): *#1 4 11(GND); U1 3(FEEDBACK)*; U2 3(FEEDBACK)*; U5 3(FEEDBACK)*

## Notes on the sheet
- (in symbol Hall_Sensor) U_Hall
- (in symbol LM324AD_SOIC14, part A) +; -
- (in symbol LM324AD_SOIC14, part B) -; +
- (in symbol LM324AD_SOIC14, part C) +; -
- (in symbol LM324AD_SOIC14, part D) -; +

## Library data of the parts
C1 C4 C5 C9 C10 C13-C15 C17-C21 C23-C30 C37-C39 = C0805C104J4RACTU
C2 C3 = Cap Pol2: Polarized Capacitor (Axial); Value: 10uF; Published: 8-Jun-2000; LatestRevisionDate: 17-Jul-2002; LatestRevisionNote: Re-released for DXP Platform.; PackageReference: POLAR0.8; Publisher: Altium Limited; PackageDescription: Polarized Capacitor; 2 Leads
C6-C8 C11 C12 C16 C22 = EEE1HA101AP: Capacitor Polarised; Manufacturer_Name: Panasonic; Datasheet Link: http://industrial.panasonic.com/cdbs/www-data/pdf/RDE0000/ABA0000C1142.pdf; Manufacturer_Part_Number: EEE1HA101AP
C31-C36 = C0805C104J4RACTU: 100pF
C40 = ECA-1JHG222: No Description Available; Mfr_Name: Panasonic; Type: DEV; Copyright: Copyright (C) 2022 Ultra Librarian. All rights reserved.; Manufacturer_Part_Number: ECA-1JHG222; RefDes: RefDes
CR1-CR4 = 1N5822RL: No Description Available; Mfr_Name: STMicroelectronics; Type: DEV; Copyright: Copyright (C) 2022 Ultra Librarian. All rights reserved.; Manufacturer_Part_Number: 1N5822RL; RefDes: RefDes
D4 D5 D10 D11 D17 D18 = LED2: Typical RED, GREEN, YELLOW, AMBER GaAs LED; Published: 8-Jun-2000; LatestRevisionDate: 17-Jul-2002; LatestRevisionNote: Re-released for DXP Platform.; PackageVersion: Feb-2002; PackageReference: 3.2X1.6X1.1; Publisher: Altium Limited; PackageDescription: SM LED; 2 Flat Leads
J1 J2 J4 J5 = 691101710002: WR-TBL Series 101 Horizontal Entry Modular, Through Hole, pitch 5mm, 2p; Manufacturer: Wurth Elektronik; Pin Number: 2; Rated Current: 16A; Working Voltage: 250V; PCB/Cable/Panel: PCB; Modularity: Yes; ComponentLink1Description: Manufacturer Link; ComponentLink1URL: https://www.we-online.com/redexpert/article/691101710002?ad; ComponentLink2Description: Datasheet; ComponentLink2URL: https://www.we-online.com/redexpert/spec/691101710002?ad; Category: Terminal Blocks; Match Code: WR-TBL; Manufacturer Part Number: 691101710002; Mount: Through Hole; Operating Temperature Max: 105°C; Operating Temperature Min: -40°C; Packaging: Box; Pitch: 5mm; Orientation: Horizontal; Application: Pressure Clamp
L1-L3 = 7445720: SMD-Power Inductor WE-PD4, L = 100 µH; Inductance: 100 ÂµH; ComponentLink1Description: Manufacturer Link; ComponentLink2Description: Datasheet; DatasheetVersion: ver 1, Oct-2004; ComponentLink1URL: http://www.we-online.com; PackageVersion: 2004; PackageDescription: SMD Inductor, 2-Leads, Body 22.0 x 15.0 mm; ComponentLink2URL: http://www.we-online.de/katalog/media/pdf/7445720.pdf; PackageReference: WE-PD4-XL; PartNumber: 7445720
P1-P6 P9-P14 = 61900311121: WR-WTB THT Male Vertical Locking Header, pitch 2.54mm, 3p; Pin Number: 3; Contact Resistance: 20mOhm; Rated Current: 3A; Withstanding Voltage: 1000VAC; Working Voltage: 250VAC; ComponentLink1Description: Manufacturer; ComponentLink1URL: http://www.we-online.de; ComponentLink2Description: Datasheet; ComponentLink2URL: https://www.we-online.com/catalog/datasheet/61900311121.pdf; Pitch: 2.54mm; Published Date: January 2020; Publisher: Wurth Elektronik; Mounting Technology: THT; Packaging: Bag; Operating Temperature: -40 to +105degC; Part Number: 61900311121; Gender: Male; Type: Vertical
P7 P8 = 61900811121: WR-WTB THT Male Vertical Locking Header, pitch 2.54mm, 8p; Pin Number: 8; Contact Resistance: 20mOhm; Rated Current: 3A; Withstanding Voltage: 1000VAC; Working Voltage: 250VAC; ComponentLink1Description: Manufacturer; ComponentLink1URL: http://www.we-online.de; ComponentLink2Description: Datasheet; ComponentLink2URL: https://www.we-online.com/catalog/datasheet/61900811121.pdf; Pitch: 2.54mm; Published Date: January 2020; Publisher: Wurth Elektronik; Mounting Technology: THT; Packaging: Bag; Operating Temperature: -40 to +105degC; Part Number: 61900811121; Gender: Male; Type: Vertical
Q2 Q4 Q6 = BC847B,215: Transistor BJT NPN; Manufacturer_Name: Nexperia; Datasheet Link: https://assets.nexperia.com/documents/data-sheet/BC847_SER.pdf; Height: 1.1mm; Manufacturer_Part_Number: BC847B,215; Mouser Part Number: 771-BC847B-T/R; Mouser Price/Stock: https://www.mouser.co.uk/ProductDetail/Nexperia/BC847B215?qs=me8TqzrmIYXXIdUoxWnHgw%3D%3D; Arrow Part Number: BC847B,215; Arrow Price/Stock: https://www.arrow.com/en/products/bc847b215/nexperia?region=nac
Q7-Q9 = IRFR9024N: Insulated-Gate Field-Effect Transistor (IGFET), P-Channel, Enhancement,  Body Diode, Pin 1 Gate,  3 Source, 4 Drain, 3Pins; Manufacturer: Infineon Technologies; Manufacturer Order Number: IRFR9024N; PackageReference: PG-TO252-3-901
R1 R2 R4-R7 R9 R12-R17 R19-R21 R27-R29 R31 R34 R36 R39 R41-R43 R47 R48 R54 R55 R58 R62 R65 R67 R68 R74 R92-R94 R101-R124 = CRCW08050000Z0EA
  R1 R2 R4 R6 R7 R9 R12-R17 R19-R21 R28 R29 R31 R34 R36 R39 R41-R43 R47 R48 R55 R58 R62 R65 R67 R68 R74 R92-R94 R101-R124: 10k: *
  R5 R27 R54: 100k: *
R3 R8 R10 R11 R18 R23 R25 R30 R32 R33 R35 R37 R38 R40 R44-R46 R50 R52 R57 R59 R61 R63 R64 R66 R70-R72 R76 R78 = CRCW08050000Z0EA: 10k; 10k: *
R22 R49 R75 = CRCW08050000Z0EA: 51k; 10k: *
R24 R51 R77 R80-R82 R86 R89-R91 R95 R98 = CRCW08050000Z0EA: 7.5k; 10k: *
R26 R53 R60 R73 R79 R83-R85 R88 R97 R100 = CRCW08050000Z0EA: 1k; 10k: *
R56 R69 = CRCW08050000Z0EA: 9.1k; 10k: *
R87 R96 R99 = TUW5JR10E: No Description Available; Mfr_Name: Ohmite; Copyright: Copyright (C) 2022 Ultra Librarian. All rights reserved.; Manufacturer_Part_Number: TUW5JR10E; RefDes: RefDes; Type: DEV
RG1 = Reg_Fairchild_LM7805CT_eec: REG IC REG LINEAR 5V 1A TO220AB; Voltage Dropout (Max): 2V @ 1A (Typ); Voltage - Input (Max): 35V; helpURL: https://upverter.com/upn/revision/b27a7358b7dd93a3/; ComponentLink2Description: Datasheet; Temperature: -40°C to +125°C; Package: TO220; Supplier 2: Mouser; Price: 0.384521982769; Supplier 1: Digi-Key; ComponentLink1URL: https://upverter.com/upn/revision/b27a7358b7dd93a3/; Supplier Part Number 2: 512-LM7805CT; Supplier Part Number 1: LM7805CT-ND; Manufacturer: Fairchild; ComponentLink1Description: Upverter; ComponentLink2URL: https://www.fairchildsemi.com/datasheets/LM/LM7805.pdf; RoHS: TRUE; Mouser Part Number: 512-LM7805CT; Ipc Land Pattern Name: TO-220; Temperature Range High: +125°C; Digikey Description: REG IC REG LINEAR 5V 1A TO220AB; Digikey Part Number: LM7805CT-ND; Lead Free: yes; Temperature Range Low: -40°C; Voltage - Output: 5V; Current-Output: 1A
RP1-RP13 = 3296W-1-202LF
TP1-TP58 = TP_PCB?: Test_Point
U1 U2 U5 = TL494ID: Pulse-Width-Modulation Control Circuit with Voltage Control, 45 % Duty Cycle, -40 to +85 degC, 16-pin SOIC (D), Green (RoHS & no Sb/Br); Manufacturer: Texas Instruments; Regulated Outputs(#): 2; Topology: Boost, Buck, Flyback, Forward, Full-Bridge, Half-Bridge, Push-Pull; SubFamily: PWM Controller; Frequency(Max)(kHz): 300; Rating: Military; Duty Cycle(Max)(%): 45; ComponentLink1URL: http://www.ti.com/general/docs/lit/getliterature.tsp?genericPartNumber=TL494&fileType=pdf; DatasheetVersion: SLVS074E; Control Method: Voltage; ComponentLink1Description: Datasheet; Code_JEDEC: MS-012AC; PackageVersion: revM, Jun-2011; Eco-Plan: Green (RoHS & no Sb/Br); PartNumber: TL494ID; PackageDescription: 16-Pin Plastic Small Outline Integrated Circuit, 9.9 x 3.9 mm, Pitch 1.27 mm Pitch; Mounting Technology: Surface Mount; PackageReference: D16
U4 = LM2576D2T-005G
U6-U11 = IC_Nexperia_TL431AQDBZR,215_eec: IC VREF SHUNT ADJ SOT23-3; Voltage - Input: 2.495 V ~ 36 V; Tolerance: ±1%; Current - Output: 100mA; Number of Channels: 1; Current - Cathode: 600µA; Reference Type: Shunt, Adjustable, Precision; Other Names: 568-4890-6; helpURL: https://upverter.com/upn/revision/897efb4cb52176e6/; ComponentLink2Description: Datasheet; Temperature: -40°C to +125°C; Package: TO-236-3, SC-59, SOT-23-3; Supplier 2: Mouser; Price: 0.155797334872; Supplier 1: Digi-Key; ComponentLink1URL: https://upverter.com/upn/revision/897efb4cb52176e6/; Supplier Part Number 2: 771-TL431AQDBZR215; Supplier Part Number 1: 1727-4259-1-ND; Manufacturer: Nexperia; ComponentLink1Description: Upverter; ComponentLink2URL: http://assets.nexperia.com/documents/data-sheet/TL431_FAM.pdf; RoHS: TRUE; Mouser Part Number: 771-TL431AQDBZR215; Operating Temperature: -40°C ~ 125°C; Temperature Range High: +125°C; Packaging: Digi-Reel®; Digikey Description: IC VREF SHUNT ADJ SOT23-3; Digikey Part Number: 1727-4259-1-ND; Standard Package: 1; Lead Free: yes; Temperature Range Low: -40°C; Mounting Type: Surface Mount; Voltage - Output: 2.495 V ~ 36 V
Z1 = MM3Z5V1ST1G: Zener Diode; Manufacturer_Name: onsemi; Datasheet Link: http://www.onsemi.com/pub/Collateral/MM3Z2V4ST1-D.PDF; Height: 1.1mm; Manufacturer_Part_Number: MM3Z5V1ST1G; Mouser Part Number: 863-MM3Z5V1ST1G; Mouser Price/Stock: https://www.mouser.co.uk/ProductDetail/onsemi/MM3Z5V1ST1G?qs=HVbQlW5zcXXFXX%2FQxsNWFg%3D%3D; Arrow Part Number: MM3Z5V1ST1G; Arrow Price/Stock: https://www.arrow.com/en/products/mm3z5v1st1g/on-semiconductor?region=nac